# EAGLE design VNC1L (EAGLE 7.6.0)
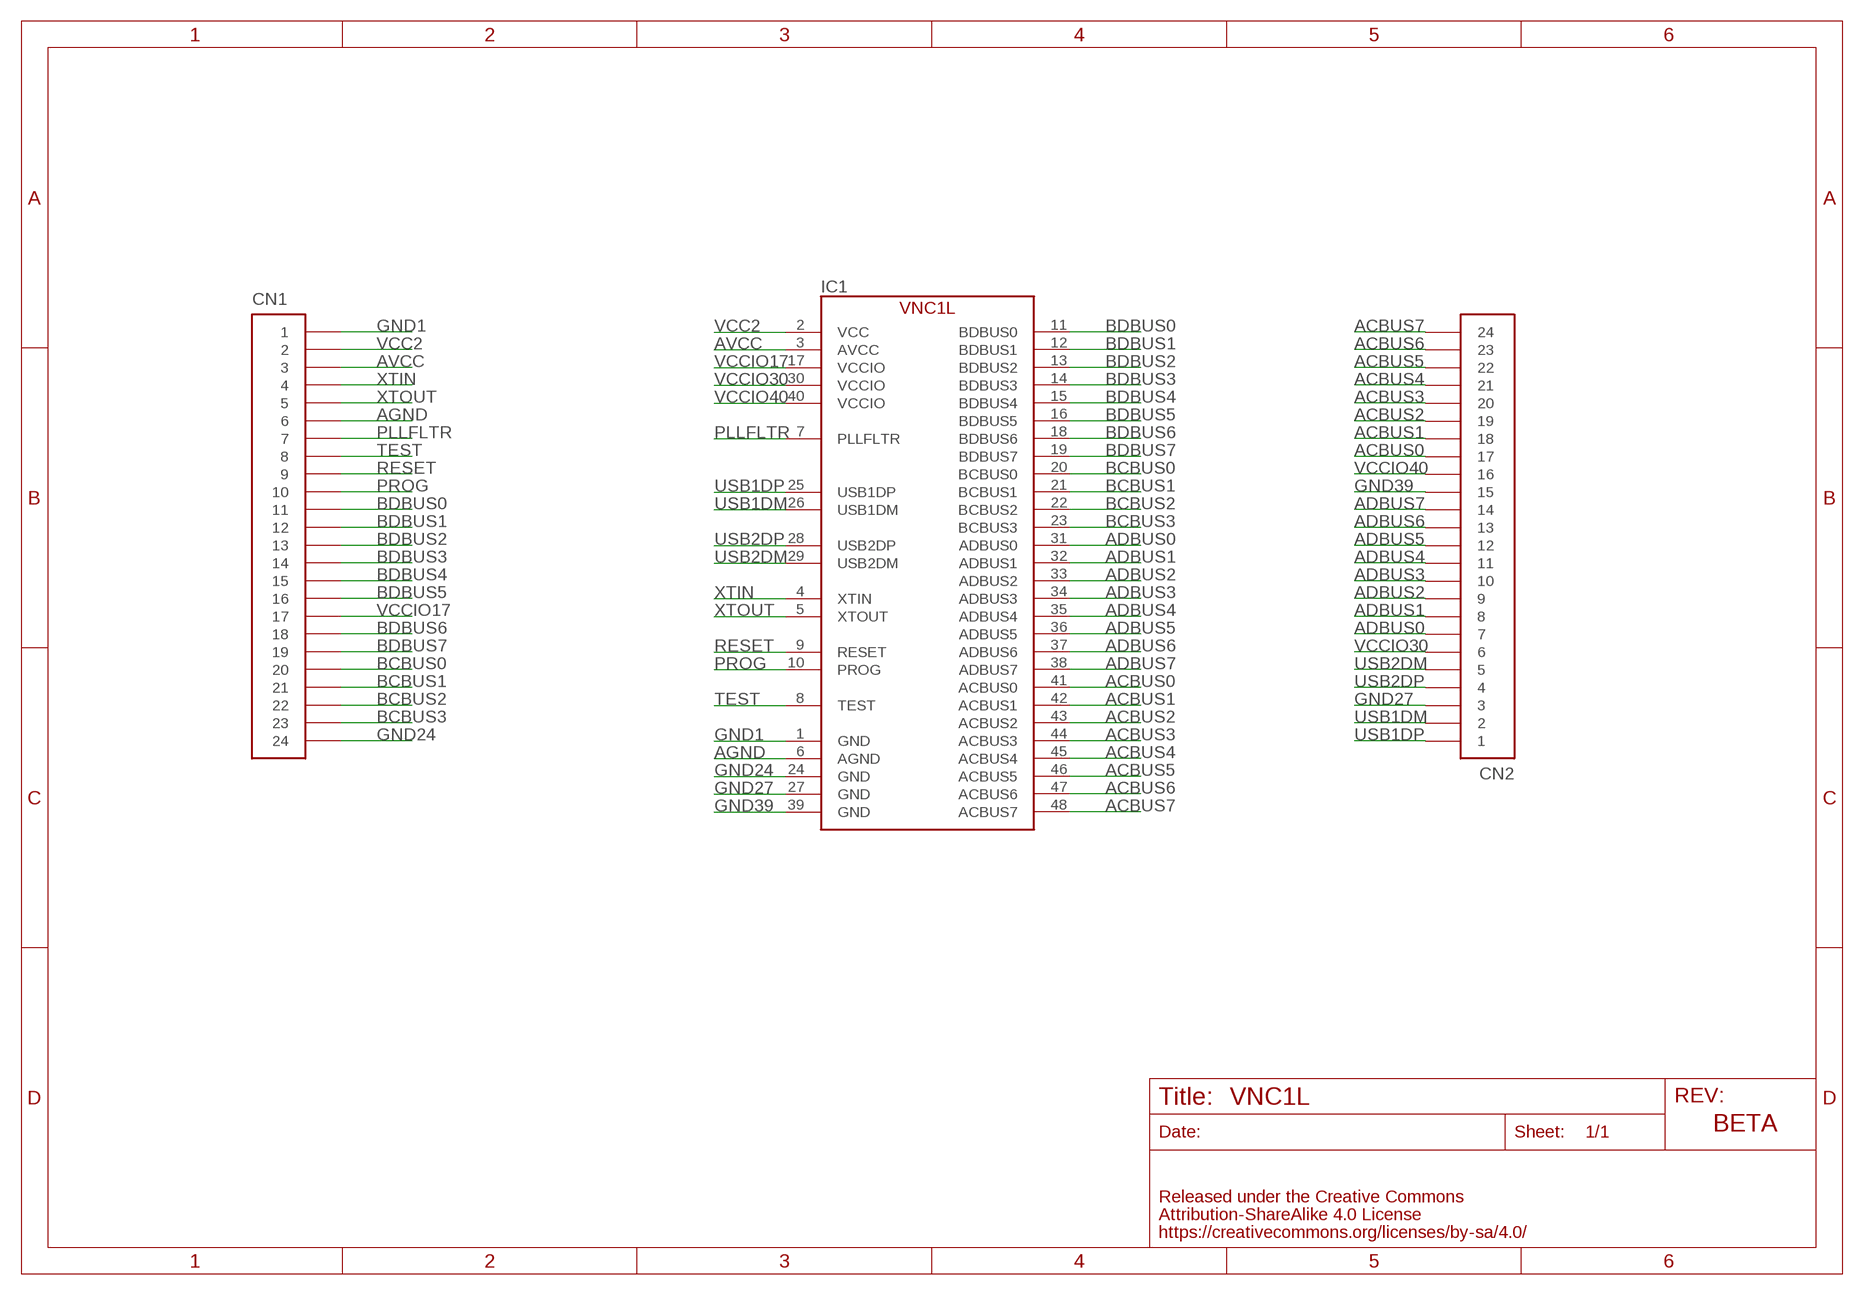
[diagram p0: schematic, sheet 1]

## Parts
CN1  PIN_HEADER_1X24  [PIN_1X24_SNEAKY]
CN2  PIN_HEADER_1X24  [PIN_1X24_SNEAKY]
IC1  VNC1L-1A  [LQFP-48]

## Nets
ACBUS0: CN2.17 IC1.41(ACBUS0)
ACBUS1: CN2.18 IC1.42(ACBUS1)
ACBUS2: CN2.19 IC1.43(ACBUS2)
ACBUS3: CN2.20 IC1.44(ACBUS3)
ACBUS4: CN2.21 IC1.45(ACBUS4)
ACBUS5: CN2.22 IC1.46(ACBUS5)
ACBUS6: CN2.23 IC1.47(ACBUS6)
ACBUS7: CN2.24 IC1.48(ACBUS7)
ADBUS0: CN2.7 IC1.31(ADBUS0)
ADBUS1: CN2.8 IC1.32(ADBUS1)
ADBUS2: CN2.9 IC1.33(ADBUS2)
ADBUS3: CN2.10 IC1.34(ADBUS3)
ADBUS4: CN2.11 IC1.35(ADBUS4)
ADBUS5: CN2.12 IC1.36(ADBUS5)
ADBUS6: CN2.13 IC1.37(ADBUS6)
ADBUS7: CN2.14 IC1.38(ADBUS7)
AGND: CN1.6 IC1.6(AGND)
AVCC: CN1.3 IC1.3(AVCC)
BCBUS0: CN1.20 IC1.20(BCBUS0)
BCBUS1: CN1.21 IC1.21(BCBUS1)
BCBUS2: CN1.22 IC1.22(BCBUS2)
BCBUS3: CN1.23 IC1.23(BCBUS3)
BDBUS0: CN1.11 IC1.11(BDBUS0)
BDBUS1: CN1.12 IC1.12(BDBUS1)
BDBUS2: CN1.13 IC1.13(BDBUS2)
BDBUS3: CN1.14 IC1.14(BDBUS3)
BDBUS4: CN1.15 IC1.15(BDBUS4)
BDBUS5: CN1.16 IC1.16(BDBUS5)
BDBUS6: CN1.18 IC1.18(BDBUS6)
BDBUS7: CN1.19 IC1.19(BDBUS7)
GND1: CN1.1 IC1.1(GND)
GND24: CN1.24 IC1.24(GND)
GND27: CN2.3 IC1.27(GND)
GND39: CN2.15 IC1.39(GND)
PLLFLTR: CN1.7 IC1.7(PLLFLTR)
PROG: CN1.10 IC1.10(PROG)
RESET: CN1.9 IC1.9(RESET)
TEST: CN1.8 IC1.8(TEST)
USB1DM: CN2.2 IC1.26(USB1DM)
USB1DP: CN2.1 IC1.25(USB1DP)
USB2DM: CN2.5 IC1.29(USB2DM)
USB2DP: CN2.4 IC1.28(USB2DP)
VCC2: CN1.2 IC1.2(VCC)
VCCIO17: CN1.17 IC1.17(VCCIO)
VCCIO30: CN2.6 IC1.30(VCCIO)
VCCIO40: CN2.16 IC1.40(VCCIO)
XTIN: CN1.4 IC1.4(XTIN)
XTOUT: CN1.5 IC1.5(XTOUT)

## Notes on the sheet
- BETA

## Library data of the parts
CN1 CN2 = FaBo-PIN:PIN_HEADER_1X24
IC1 = FaBo-USB:VNC1L

## Board
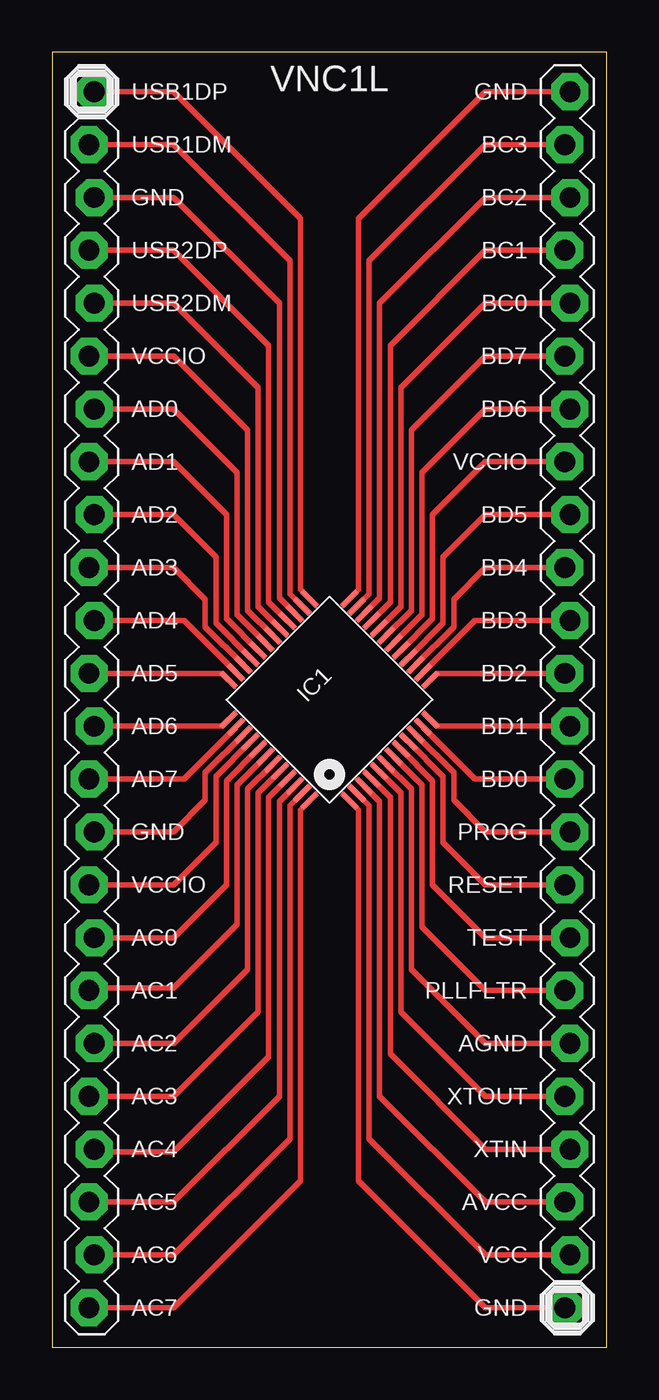
[diagram p1: board, top side]

Size 26.67 x 62.23 mm. Coordinates in mm from the lower left corner, seen from the top.
Outline: 0,0 26.67,0 26.67,62.23 0,62.23 0,0
Copper layers (1*16): Top 0.035mm / dielectric 1.5mm / Bottom 0.035mm
Design rules "SeeedStudio_2layer_DRU_no_angle_20140221": minimum track width 6mil, minimum drill 12mil, track to track 6mil, track to pad 6mil, pad to pad 6mil, via to via 6mil, smd to smd 0mil, copper to edge 10mil, drill to drill 10mil, minimum pad ring 10mil, minimum via ring 6mil, stop-mask expansion 2mil, vias tented up to drill 100mil, thermal gap 10mil

### Footprints (pad centres in the part's own frame; a part is rotated, then mirrored left to right if it is on the bottom)
PIN_1X24_SNEAKY = drill 1 pad 1.778 octagon: 1 -29.21,0.127; 2 -26.67,-0.127; 3 -24.13,0.127; 4 -21.59,-0.127; 5 -19.05,0.127; 6 -16.51,-0.127; 7 -13.97,0.127; 8 -11.43,-0.127; 9 -8.89,0.127; 10 -6.35,-0.127; 11 -3.81,0.127; 12 -1.27,-0.127; 13 1.27,0.127; 14 3.81,-0.127; 15 6.35,0.127; 16 8.89,-0.127; 17 11.43,0.127; 18 13.97,-0.127; 19 16.51,0.127; 20 19.05,-0.127; 21 21.59,0.127; 22 24.13,-0.127; 23 26.67,0.127; 24 29.21,-0.127
LQFP-48 = smd 0.27 x 1.05: 1 -2.75,-4.1; 2 -2.25,-4.1; 3 -1.75,-4.1; 4 -1.25,-4.1; 5 -0.75,-4.1; 6 -0.25,-4.1; 7 0.25,-4.1; 8 0.75,-4.1; 9 1.25,-4.1; 10 1.75,-4.1; 11 2.25,-4.1; 12 2.75,-4.1; 25 2.75,4.1; 26 2.25,4.1; 27 1.75,4.1; 28 1.25,4.1; 29 0.75,4.1; 30 0.25,4.1; 31 -0.25,4.1; 32 -0.75,4.1; 33 -1.25,4.1; 34 -1.75,4.1; 35 -2.25,4.1; 36 -2.75,4.1 | smd 1.05 x 0.27: 13 4.1,-2.75; 14 4.1,-2.25; 15 4.1,-1.75; 16 4.1,-1.25; 17 4.1,-0.75; 18 4.1,-0.25; 19 4.1,0.25; 20 4.1,0.75; 21 4.1,1.25; 22 4.1,1.75; 23 4.1,2.25; 24 4.1,2.75; 37 -4.1,2.75; 38 -4.1,2.25; 39 -4.1,1.75; 40 -4.1,1.25; 41 -4.1,0.75; 42 -4.1,0.25; 43 -4.1,-0.25; 44 -4.1,-0.75; 45 -4.1,-1.25; 46 -4.1,-1.75; 47 -4.1,-2.25; 48 -4.1,-2.75

### Placement (x,y rotation side)
CN1  24.77,31.11 90 top
CN2  1.91,31.11 270 top
IC1  13.34,31.11 45 top

### Tracks (layer width: path | path; a pad name or v marks a point on that pad's centre or on a via)
ACBUS0
  Top 0.254: CN2.17 5.84,19.68 8.38,22.23 8.38,27.22 IC1.41
ACBUS1
  Top 0.254: CN2.18 1.91,17.27 5.84,17.27 8.89,20.32 8.89,24.13 8.89,24.77 8.89,27.02 IC1.42
ACBUS2
  Top 0.254: CN2.19 5.84,14.61 9.4,18.16 9.4,26.82 IC1.43
ACBUS3
  Top 0.254: CN2.20 5.84,12.06 9.91,16.13 9.91,26.62 IC1.44
ACBUS4
  Top 0.254: CN2.21 2.16,9.4 5.84,9.4 10.41,13.97 10.41,26.43 IC1.45
ACBUS5
  Top 0.254: CN2.22 5.84,6.99 10.92,12.06 10.92,26.23 IC1.46
ACBUS6
  Top 0.254: CN2.23 5.84,4.45 11.43,10.03 11.43,26.03 IC1.47
ACBUS7
  Top 0.254: CN2.24 5.84,1.91 11.94,8 11.94,25.83 IC1.48
ADBUS0
  Top 0.254: CN2.7 5.84,45.09 8.89,42.04 8.89,35.21 IC1.31
ADBUS1
  Top 0.254: CN2.8 5.84,42.55 8.38,40.01 8.38,35.01 IC1.32
ADBUS2
  Top 0.254: CN2.9 5.84,40.01 7.87,37.97 7.87,34.81 IC1.33
ADBUS3
  Top 0.254: CN2.10 5.84,37.47 7.37,35.94 7.37,34.61 IC1.34
ADBUS4
  Top 0.254: CN2.11 5.71,34.92 5.84,34.92 6.34,34.92 IC1.35
ADBUS5
  Top 0.254: CN2.12 8.18,32.38 IC1.36
ADBUS6
  Top 0.254: CN2.13 8.18,29.84 IC1.37
ADBUS7
  Top 0.254: CN2.14 6.34,27.3 IC1.38
AGND
  Top 0.254: IC1.6 17.27,26.82 17.27,18.16 20.83,14.61 CN1.6
AVCC
  Top 0.254: IC1.3 15.75,26.23 15.75,12.06 20.83,6.99 CN1.3
BCBUS0
  Top 0.254: CN1.20 20.83,50.16 16.76,46.1 16.76,35.6 IC1.20
BCBUS1
  Top 0.254: CN1.21 20.83,52.7 16.26,48.13 16.26,35.8 IC1.21
BCBUS2
  Top 0.254: CN1.22 20.83,55.24 15.75,50.16 15.75,36 IC1.22
BCBUS3
  Top 0.254: CN1.23 20.83,57.78 15.24,52.2 15.24,36.2 IC1.23
BDBUS0
  Top 0.254: CN1.11 20.33,27.3 IC1.11
BDBUS1
  Top 0.254: CN1.12 18.49,29.84 IC1.12
BDBUS2
  Top 0.254: CN1.13 18.49,32.38 IC1.13
BDBUS3
  Top 0.254: CN1.14 20.33,34.92 IC1.14
BDBUS4
  Top 0.254: CN1.15 20.83,37.47 19.3,35.94 19.3,34.61 IC1.15
BDBUS5
  Top 0.254: CN1.16 20.83,40.01 18.8,37.97 18.8,34.81 IC1.16
BDBUS6
  Top 0.254: CN1.18 20.83,45.09 17.78,42.04 17.78,35.21 IC1.18
BDBUS7
  Top 0.254: CN1.19 20.83,47.62 17.27,44.07 17.27,35.41 IC1.19
GND1
  Top 0.254: IC1.1 14.73,25.83 14.73,8 20.83,1.91 CN1.1
GND24
  Top 0.254: CN1.24 20.83,60.33 14.73,54.23 14.73,36.4 IC1.24
GND27
  Top 0.254: CN2.3 5.84,55.24 10.92,50.16 10.92,36 IC1.27
GND39
  Top 0.254: CN2.15 5.84,24.77 7.37,26.29 7.37,27.62 IC1.39
PLLFLTR
  Top 0.254: IC1.7 17.78,27.02 17.78,20.19 20.83,17.14 CN1.7
PROG
  Top 0.254: IC1.10 19.3,27.62 19.3,26.29 20.83,24.77 CN1.10
RESET
  Top 0.254: IC1.9 18.8,27.42 18.8,24.26 20.83,22.23 CN1.9
TEST
  Top 0.254: IC1.8 18.29,27.22 18.29,22.23 20.83,19.68 CN1.8
USB1DM
  Top 0.254: CN2.2 5.84,57.78 11.43,52.2 11.43,36.2 IC1.26
USB1DP
  Top 0.254: CN2.1 5.84,60.33 11.94,54.23 11.94,36.4 IC1.25
USB2DM
  Top 0.254: CN2.5 5.84,50.16 9.91,46.1 9.91,35.6 IC1.29
USB2DP
  Top 0.254: CN2.4 5.84,52.7 10.41,48.13 10.41,35.8 IC1.28
VCC2
  Top 0.254: IC1.2 15.24,26.03 15.24,10.03 20.83,4.45 CN1.2
VCCIO17
  Top 0.254: CN1.17 20.83,42.55 18.29,40.01 18.29,35.01 IC1.17
VCCIO30
  Top 0.254: CN2.6 5.84,47.62 9.4,44.07 9.4,35.41 IC1.30
VCCIO40
  Top 0.254: CN2.16 5.84,22.23 7.87,24.26 7.87,27.42 IC1.40
XTIN
  Top 0.254: IC1.4 16.26,26.43 16.26,14.1 20.83,9.53 CN1.4
XTOUT
  Top 0.254: IC1.5 16.76,26.62 16.76,16.13 20.83,12.06 CN1.5

### Text on the board
tPlace: VNC1L | USB1DP | GND | USB1DM | BC3 | GND | BC2 | USB2DP | BC1 | USB2DM | BC0 | VCCIO | BD7 | AD0 | BD6 | AD1 | VCCIO | AD2 | BD5 | AD3 | BD4 | AD4 | BD3 | AD5 | BD2 | AD6 | BD1 | AD7 | BD0 | GND | PROG | VCCIO | RESET | AC0 | TEST | AC1 | PLLFLTR | AC2 | AGND | AC3 | XTOUT | AC4 | XTIN | AC5 | AVCC | AC6 | VCC | AC7 | GND